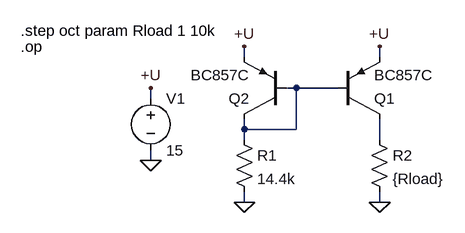
[diagram p0: schematic mirror-1.asc]
mirror-1.asc, the LTspice schematic file:
Version 4
SHEET 1 880 680
WIRE 192 48 192 32
WIRE 400 48 400 32
WIRE 272 96 256 96
WIRE 336 96 272 96
WIRE 48 112 48 96
WIRE 192 160 192 144
WIRE 272 160 272 96
WIRE 272 160 192 160
WIRE 192 176 192 160
WIRE 400 176 400 144
WIRE 48 208 48 192
WIRE 192 272 192 256
WIRE 400 272 400 256
FLAG 48 208 0
FLAG 48 96 +U
FLAG 192 272 0
FLAG 192 32 +U
FLAG 400 32 +U
FLAG 400 272 0
SYMBOL voltage 48 96 R0
WINDOW 123 0 0 Left 2
WINDOW 39 0 0 Left 2
SYMATTR InstName V1
SYMATTR Value 15
SYMBOL pnp 336 144 M180
SYMATTR InstName Q1
SYMATTR Value BC857C
SYMBOL pnp 256 144 R180
SYMATTR InstName Q2
SYMATTR Value BC857C
SYMBOL res 176 160 R0
SYMATTR InstName R1
SYMATTR Value 14.4k
SYMBOL res 384 160 R0
SYMATTR InstName R2
SYMATTR Value {Rload}
TEXT -152 8 Left 2 !.step oct param Rload 1 10k
TEXT -152 32 Left 2 !.op

The netlist it stands for:
* mirror-1.asc
V1 +U 0 15
Q1 N002 N001 +U 0 BC857C
Q2 N001 N001 +U 0 BC857C
R1 N001 0 14.4k
R2 N002 0 {Rload}
.model NPN NPN
.model PNP PNP
.lib standard.bjt
.step oct param Rload 1 10k
.op
.backanno
.end